# EAGLE design w10dc_motor (EAGLE 8.2.0)
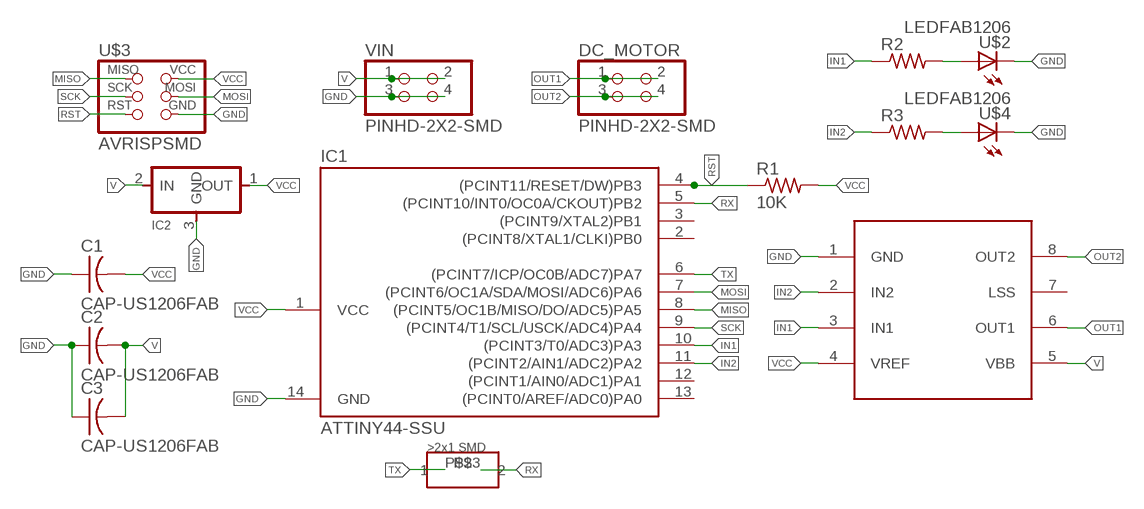
[diagram p0: schematic, sheet 1]

## Parts
C1  CAP-US1206FAB  [C1206FAB]
C2  CAP-US1206FAB  [C1206FAB]
C3  CAP-US1206FAB  [C1206FAB]
DC_MOTOR  PINHD-2X2-SMD  [2X02SMD]
IC1  ATTINY44-SSU  [SOIC14]
IC2  REGULATORSOT23  [SOT23]
R1  10K  RES-US1206FAB  [R1206FAB]
R2  RES-US1206FAB  [R1206FAB]
R3  RES-US1206FAB  [R1206FAB]
U$1  A4953-H-BRIDGE-MOTOR-DRIVER  [SOIC8]
U$2  LEDFAB1206  [LED1206FAB]
U$3  AVRISPSMD  [2X03SMD]
U$4  LEDFAB1206  [LED1206FAB]
U$5  2X1SMD  [PINHD-2X1-SMD]
VIN  PINHD-2X2-SMD  [2X02SMD]

## Nets
GND: C1.1 C2.1 C3.1 IC1.14(GND) IC2.3(GND) U$1.1(GND) U$2.2(C) U$3.6(GND) U$4.2(C) VIN.3 VIN.4
IN1: IC1.10((PCINT3/T0/ADC3)PA3) R2.1 U$1.3(IN1)
IN2: IC1.11((PCINT2/AIN1/ADC2)PA2) R3.1 U$1.2(IN2)
MISO: IC1.8((PCINT5/OC1B/MISO/DO/ADC5)PA5) U$3.1(MISO)
MOSI: IC1.7((PCINT6/OC1A/SDA/MOSI/ADC6)PA6) U$3.4(MOSI)
N$1: R2.2 U$2.1(A)
N$2: R3.2 U$4.1(A)
OUT1: DC_MOTOR.1 DC_MOTOR.2 U$1.6(OUT1)
OUT2: DC_MOTOR.3 DC_MOTOR.4 U$1.8(OUT2)
RST: IC1.4((PCINT11/RESET/DW)PB3) R1.1 U$3.5(RST)
RX: IC1.5((PCINT10/INT0/OC0A/CKOUT)PB2) U$5.P$3
SCK: IC1.9((PCINT4/T1/SCL/USCK/ADC4)PA4) U$3.3(SCK)
TX: IC1.6((PCINT7/ICP/OC0B/ADC7)PA7) U$5.P$2
V: C2.2 C3.2 IC2.2(IN) U$1.5(VBB) VIN.1 VIN.2
VCC: C1.2 IC1.1(VCC) IC2.1(OUT) R1.2 U$1.4(VREF) U$3.2(VCC)
Unconnected: IC1.2((PCINT8/XTAL1/CLKI)PB0) IC1.3((PCINT9/XTAL2)PB1) IC1.12((PCINT1/AIN0/ADC1)PA1) IC1.13((PCINT0/AREF/ADC0)PA0) U$1.7(LSS)

## Library data of the parts
C1-C3 = fab:CAP-US
DC_MOTOR VIN = fab:PINHD-2X2-SMD
IC1 = fab:ATTINY44
IC2 = fab:REGULATOR
R1-R3 = fab:RES-US: Resistor (US Symbol) Variants with postfix FAB are widened to allow the routing of internal traces
U$1 = fab:A4953-H-BRIDGE-MOTOR-DRIVER
U$2 U$4 = fab:LED: LED
U$3 = fab:AVRISP
U$5 = Hashim:2X1SMD

## Board
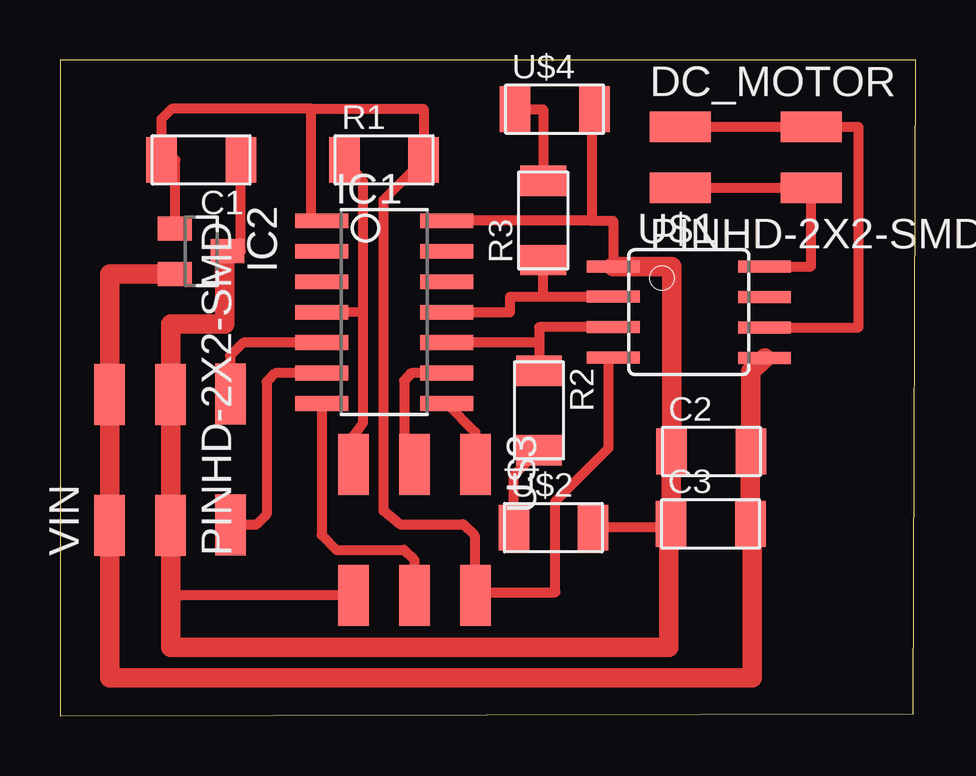
[diagram p1: board, top side]

Size 35.66 x 27.35 mm. Coordinates in mm from the lower left corner, seen from the top.
Outline: 0.01,0 35.54,0.08 35.66,27.35 0,27.35 0.01,0
Copper layers (1*16): Top 0.035mm / dielectric 1.5mm / Bottom 0.035mm
Design rules "default *": minimum track width 10mil, minimum drill 24mil, track to track 16mil, track to pad 16mil, pad to pad 8mil, via to via 8mil, smd to smd 8mil, copper to edge 40mil, drill to drill 8mil, minimum pad ring 10mil, minimum via ring 8mil, stop-mask expansion 4mil, vias tented up to drill 0mil, thermal gap 10mil

### Footprints (pad centres in the part's own frame; a part is rotated, then mirrored left to right if it is on the bottom)
C1206FAB = smd 1.27 x 1.905: 1 -1.651,0; 2 1.651,0
2X02SMD = smd 2.54 x 1.27: 1 -2.54,1.27; 2 2.92,1.27; 3 -2.54,-1.27; 4 2.92,-1.27
SOIC14 = smd 0.61 x 2.21: 1 -3.81,-2.603; 2 -2.54,-2.603; 3 -1.27,-2.603; 4 0,-2.603; 5 1.27,-2.603; 6 2.54,-2.603; 7 3.81,-2.603; 8 3.81,2.603; 9 2.54,2.603; 10 1.27,2.603; 11 0,2.603; 12 -1.27,2.603; 13 -2.54,2.603; 14 -3.81,2.603
SOT23 = smd 1 x 1.4: 1 -0.95,-1.1; 2 0.95,-1.1; 3 0,1.1
R1206FAB = smd 1.27 x 1.905: 1 -1.651,0; 2 1.651,0
SOIC8 = smd 0.5 x 2.2: 1 -1.905,-3.154; 2 -0.645,-3.154; 3 0.625,-3.154; 4 1.895,-3.154; 5 1.905,3.154; 6 0.635,3.154; 7 -0.635,3.154; 8 -1.905,3.154
LED1206FAB = smd 1.27 x 1.905: 1 -1.651,0; 2 1.651,0
2X03SMD = smd 2.54 x 1.27: 1 -2.54,2.54; 2 2.92,2.54; 3 -2.54,0; 4 2.92,0; 5 -2.54,-2.54; 6 2.92,-2.54
PINHD-2X1-SMD = smd 2.54 x 1.27: P$2 2.92,1.27; P$3 -2.54,1.27

### Placement (x,y rotation side)
C1  5.88,23.18 180 top
C2  27.14,11.02 0 top
C3  27.11,8 0 top
DC_MOTOR  28.38,23.28 0 top
IC1  13.5,16.83 270 top
IC2  5.88,19.37 270 top
R1  13.5,23.18 0 top
R2  19.96,12.74 270 top
R3  20.13,20.65 90 top
U$1  26.2,16.83 270 top
U$2  20.56,7.85 0 top
U$3  14.77,7.94 270 top
U$4  20.61,25.29 0 top
U$5  5.83,10.88 270 top
VIN  3.34,10.48 90 top

### Tracks (layer width: path | path; a pad name or v marks a point on that pad's centre or on a via)
GND
  Top 0.152: C2.1 25.46,11
  Top 0.406: U$3.6 4.99,5.02 4.61,5.4 | C1.1 7.53,19.37 IC2.3 6.87,19.37 | 25.22,8 C3.1 | C3.1 25.46,7.85 U$2.2 | 25.37,8 C3.1 | 25.22,8.25 C3.1 | U$1.1 23.05,20.64 22.15,20.64 | 22.15,20.64 IC1.14 | U$4.2 22.15,25.29 22.15,20.64
  Top 0.813: 6.87,19.37 6.87,16.34 4.61,16.34 VIN.4 VIN.3 4.61,5.4 4.61,2.86 25.37,2.86 25.37,8 | C3.1 25.46,11 | U$1.1 25.49,18.74 C2.1
IN1
  Top 0.406: 19.96,15.56 IC1.10 | 19.96,15.56 R2.1 | U$1.3 19.96,16.21 19.96,15.56
IN2
  Top 0.406: 20.13,17.48 U$1.2 | 20.13,17.48 R3.1 | IC1.11 18.76,16.83 18.76,17.48 20.13,17.48
MISO
  Top 0.406: U$3.1 17.31,11.82 IC1.8
MOSI
  Top 0.406: IC1.7 10.9,7.54 11.5,6.93 14.33,6.93 14.76,6.5 U$3.4
N$1
  Top 0.406: U$2.1 18.91,10.03 R2.2
N$2
  Top 0.406: U$4.1 20.13,25.29 R3.2
OUT1
  Top 0.406: DC_MOTOR.1 DC_MOTOR.2 33.28,24.55 33.28,16.2 U$1.6
OUT2
  Top 0.406: DC_MOTOR.3 DC_MOTOR.4 31.3,18.74 U$1.8
RST
  Top 0.406: U$3.5 12.23,11.68 12.63,12.22 12.63,16.8 | 12.63,16.8 12.63,22.28 R1.1 | IC1.4 12.58,16.85 12.63,16.8
RX
  Top 0.406: IC1.5 7.64,15.56 7.09,15.02 7.09,13.43 U$5.P$3
SCK
  Top 0.406: IC1.9 14.63,14.29 14.34,13.96 14.34,10.81 U$3.3
TX
  Top 0.406: IC1.6 8.98,14.29 8.6,13.92 8.6,8.4 8.17,7.97 7.12,7.97 U$5.P$2
V
  Top 0.406: 28.85,7.91 C3.2 | 28.76,10.81 C2.2 28.52,11.64 | U$1.5 29.35,14.92
  Top 0.813: IC2.2 2.07,18.42 VIN.2 VIN.1 2.07,1.6 28.85,1.6 28.85,7.91 | C3.2 28.76,10.81 | C2.2 28.79,14.36 U$1.5
VCC
  Top 0.406: R1.2 14.99,23.18 | IC2.1 4.81,20.32 4.81,23.18 C1.2 | C1.2 | IC1.1 10.48,20.64 10.48,25.31 | 10.48,25.31 15.15,25.31 R1.2 | 10.48,25.31 4.66,25.31 4.23,24.88 C1.2 | U$1.4 22.86,14.94 22.86,11.17 20.64,8.95 20.64,5.15 17.31,5.15 U$3.2 17.27,5.06 17.27,7.52 16.8,7.99 14.17,7.99 13.48,8.54 13.48,21.52 R1.2